# Altium schematic sheet Led.SchDoc
size A4
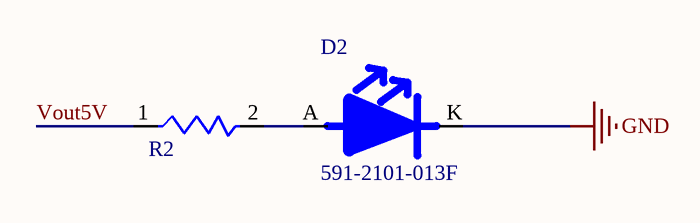
[diagram p0: Led.SchDoc]

## Parts
D2  591-2101-013F  [LED5MM]
R2  Res  [R1]  (value not drawn)

## Nets
GND: D2.K
Vout5V: R2.1
NetD2_A: D2.A R2.2

## Library data of the parts
D2 = 591-2101-013F: Manufacturer: Dialight; Color: Red; Wavelength - Peak: 660nm; Configuration: Single; Current: 20mA; Millicandela Rating: 38mcd; Lens Style/Size: Round with Domed Top, 3mm; Voltage Rating: 1.8V; Supplier 1: Digi-Key; Manufacturer Part Number: 591-2101-013F; RoHS: RoHS Compliant; Category: Optoelectronics; Stock 1: 2318; Pricing 1: 1=2.21, 10=1.768, 25=1.3504, 100=1.2275, 250=1.0802, 500=0.90836 (USD); Packaging: Digi-Reel®; Viewing Angle: -; Lens Type: -; Mounting Type: Surface Mount, Right Angle; ComponentLink1URL: http://www.dialight.com/Assets/Drawings/2D_Drawings_DrawingDetailedSpec/C17354.pdf; ComponentLink1Description: http://www.dialight.com/Assets/Drawings/2D_Drawings_DrawingDetailedSpec/C17354.pdf
R2 = CF14JT10K0: RES 10K OHM 1/4W 5% CARBON FILM; Manufacturer: Stackpole Electronics Inc; Power (Watts): 0.25W, 1/4W; Temperature Coefficient: 0/ -500ppm/°C; Supplier 1: Digi-Key; Manufacturer Part Number: CF14JT10K0; RoHS: RoHS Compliant; Category: Resistors; Stock 1: 600000; Pricing 1: 5000=0.00475, 10000=0.00413, 25000=0.00363, 50000=0.00333, 125000=0.00326 (USD); Packaging: Tape & Reel (TR); Resistance (Ohms): 10k; Tolerance: ±5%; Composition: Carbon Film; Features: Flame Retardant Coating, Moisture Resistant; Operating Temperature: -55°C ~ 155°C; Package / Case: Axial; Supplier Device Package: Axial; Size / Dimension: 0.091" Dia x 0.256" L (2.30mm x 6.50mm); Height: -; Number of Terminations: 2; ComponentLink1URL: http://www.seielect.com/catalog/SEI-CF_CFM.pdf; ComponentLink1Description: http://www.seielect.com/catalog/SEI-CF_CFM.pdf